# EAGLE design MiniTest (EAGLE 9.1.1)
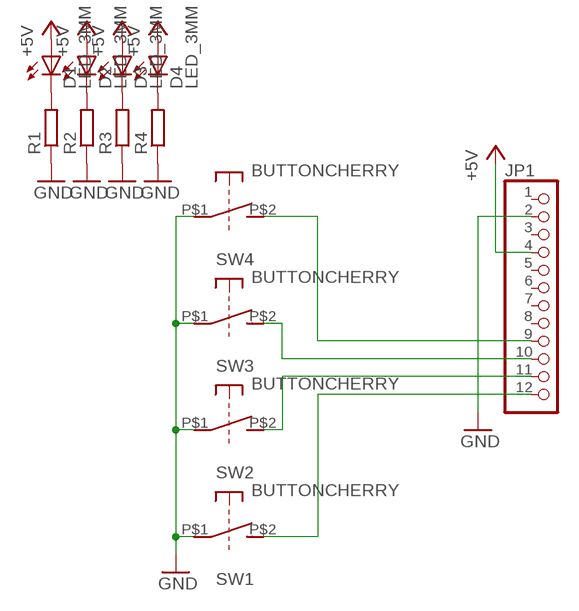
[diagram p0: schematic, sheet 1]

## Parts
D1  LED_3MM  [LED3MM]
D2  LED_3MM  [LED3MM]
D3  LED_3MM  [LED3MM]
D4  LED_3MM  [LED3MM]
JP1  PINHD-1X12  [1X12]
R1  R_R1206  [RESC3216X60]
R2  R_R1206  [RESC3216X60]
R3  R_R1206  [RESC3216X60]
R4  R_R1206  [RESC3216X60]
SW1  BUTTONCHERRY  [SW_GATERON]
SW2  BUTTONCHERRY  [SW_GATERON]
SW3  BUTTONCHERRY  [SW_GATERON]
SW4  BUTTONCHERRY  [SW_GATERON]

## Nets
+5V: D1.A D2.A D3.A D4.A JP1.4
GND: JP1.2 R1.1 R2.1 R3.1 R4.1 SW1.P$1 SW2.P$1 SW3.P$1 SW4.P$1
N$1: JP1.9 SW4.P$2
N$2: JP1.10 SW3.P$2
N$3: JP1.11 SW2.P$2
N$4: JP1.12 SW1.P$2
N$5: D1.K(C) R1.2
N$6: D2.K(C) R2.2
N$7: D3.K(C) R3.2
N$8: D4.K(C) R4.2
Unconnected: JP1.1 JP1.3 JP1.5 JP1.6 JP1.7 JP1.8

## Library data of the parts
D1-D4 = Flamberm:LED_
JP1 = pinhead:PINHD-1X12: PIN HEADER
R1-R4 = Flamberm:R_
SW1-SW4 = Flamberm:BUTTON

## Board
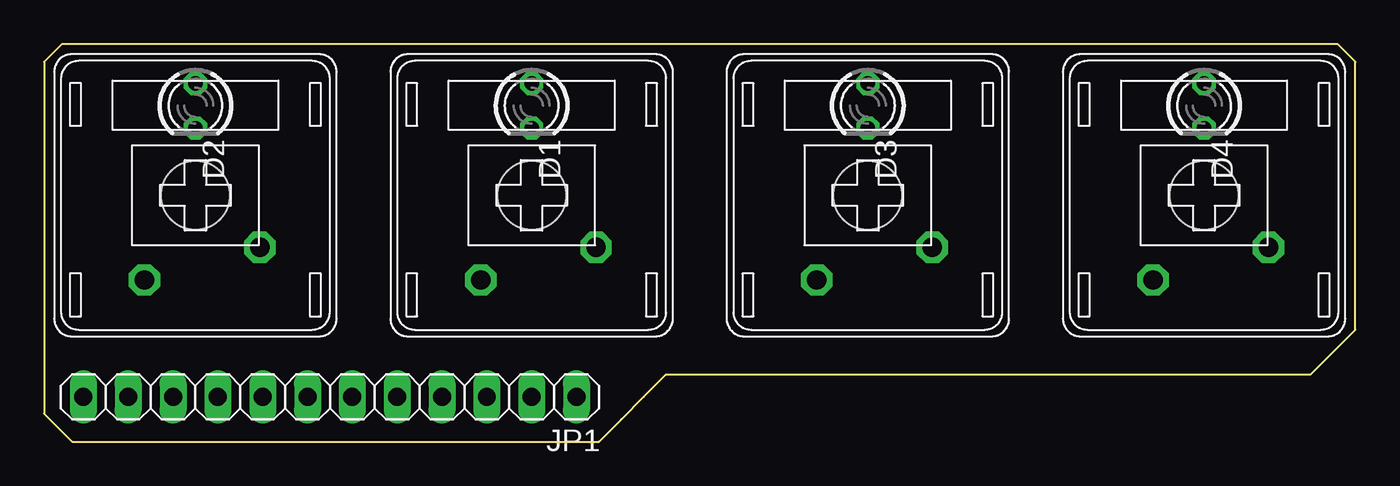
[diagram p1: board, top side]
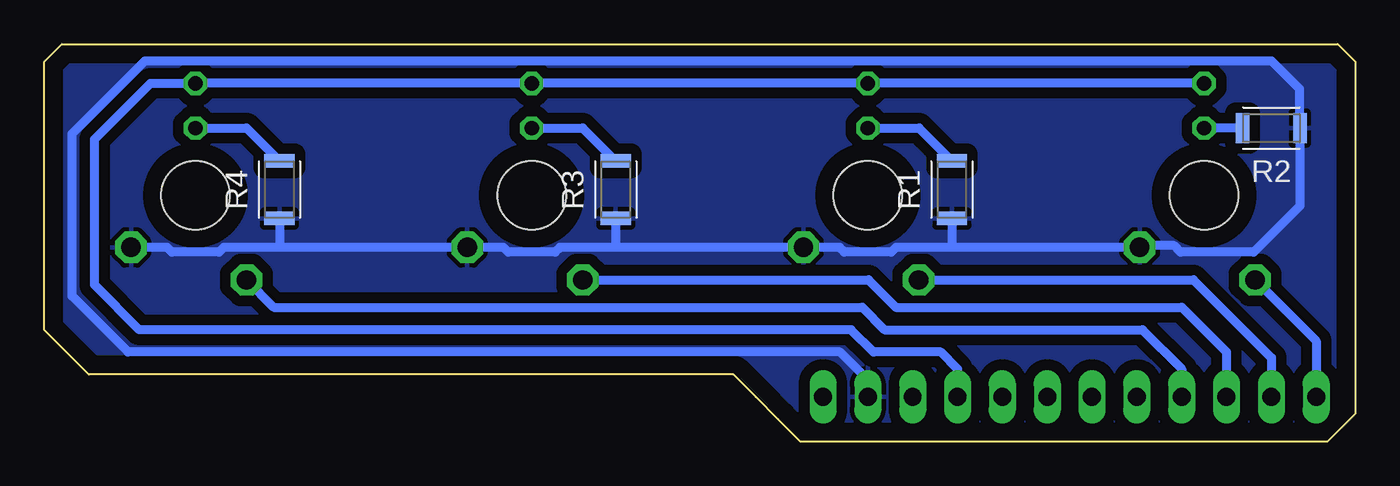
[diagram p2: board, bottom side, seen from below]

Size 74.29 x 22.54 mm. Coordinates in mm from the lower left corner, seen from the top.
Outline: 1.59,0 31.43,0 32.7,1.27 33.97,2.54 35.24,3.81 71.76,3.81 74.29,6.35 74.29,21.54 73.29,22.54 1,22.54 0,21.54 0,1.59 1.59,0
Copper layers (1*16): Top 0.035mm / dielectric 1.5mm / Bottom 0.035mm
Design rules "default": minimum track width 6mil, minimum drill 0.35mm, track to track 6mil, track to pad 6mil, pad to pad 6mil, via to via 6mil, smd to smd 6mil, copper to edge 40mil, drill to drill 6mil, minimum pad ring 10mil, minimum via ring 8mil, stop-mask expansion 4mil, vias tented up to drill 0mil, thermal gap 10mil

### Footprints (pad centres in the part's own frame; a part is rotated, then mirrored left to right if it is on the bottom)
LED3MM = drill 0.813 octagon: A -1.27,0; K 1.27,0
1X12 = drill 1.016 long: 1 -13.97,0; 2 -11.43,0; 3 -8.89,0; 4 -6.35,0; 5 -3.81,0; 6 -1.27,0; 7 1.27,0; 8 3.81,0; 9 6.35,0; 10 8.89,0; 11 11.43,0; 12 13.97,0
RESC3216X60 = smd 0.762 x 1.712: 1 -1.625,0; 2 1.625,0
SW_GATERON = drill 1.1 pad 1.778 octagon: P$1 -3.65,2.95; P$2 2.89,4.8 | hole 3.9: 0,0

### Placement (x,y rotation side)
D1  27.62,19.05 270 top
D2  8.57,19.05 270 top
D3  46.67,19.05 270 top
D4  65.72,19.05 270 top
JP1  16.19,2.54 180 top
R1  22.86,14.29 90 bottom
R2  4.76,17.78 180 bottom
R3  41.91,14.29 90 bottom
R4  60.96,14.29 90 bottom
SW1  8.57,13.97 180 top
SW2  27.62,13.97 180 top
SW3  46.67,13.97 180 top
SW4  65.72,13.97 180 top

### Tracks (layer width: path | path; a pad name or v marks a point on that pad's centre or on a via)
+5V
  Bottom 0.508: JP1.4 22.54,4.13 23.49,5.08 27.3,5.08 28.58,6.35 68.9,6.35 71.44,8.89 71.44,17.14 68.26,20.32 D4.A D3.A D1.A D2.A
GND
  Bottom 0.508: JP1.2 27.62,3.49 29.21,5.08 69.53,5.08 72.71,8.26 72.71,17.46 68.58,21.59 4.76,21.59 3.18,20 3.18,17.82 R2.1 3.14,13.37 5.76,10.75 9.91,10.75 10.27,11.11 12.13,11.11 SW1.P$1 22.86,11.02 | 22.86,11.02 26.02,11.02 26.29,10.75 28.96,10.75 29.23,11.02 SW2.P$1 41.91,11.02 | 41.91,11.02 45.07,11.02 45.34,10.75 48.01,10.75 48.28,11.02 SW3.P$1 60.96,11.02 | 60.96,11.02 64.12,11.02 64.39,10.75 67.06,10.75 67.33,11.02 SW4.P$1 | R4.1 60.96,11.02 | R3.1 41.91,11.02 | R1.1 22.86,11.02
  pour Bottom (isolate 0.61): 0,1.59 1.59,0 31.43,0 35.24,3.81 71.75,3.81 74.29,6.35 74.29,21.59 73.34,22.54 0.95,22.54 0,21.59
N$1
  Bottom 0.508: SW4.P$2 61.28,7.62 27.94,7.62 26.67,6.35 12.06,6.35 9.84,4.13 JP1.9
N$2
  Bottom 0.508: SW3.P$2 27.58,9.17 26.03,7.62 9.84,7.62 7.3,5.08 JP1.10
N$3
  Bottom 0.508: SW2.P$2 9.17,9.17 4.76,4.76 JP1.11
N$4
  Bottom 0.508: SW1.P$2 2.22,5.71 JP1.12
N$5
  Bottom 0.508: D1.K 24.73,17.78 R1.2
N$6
  Bottom 0.508: R2.2 D2.K
N$7
  Bottom 0.508: D3.K 43.78,17.78 R3.2
N$8
  Bottom 0.508: D4.K 62.83,17.78 R4.2